# Altium schematic sheet Power.SchDoc
size A; SheetNumber: 1; SheetTotal: 3
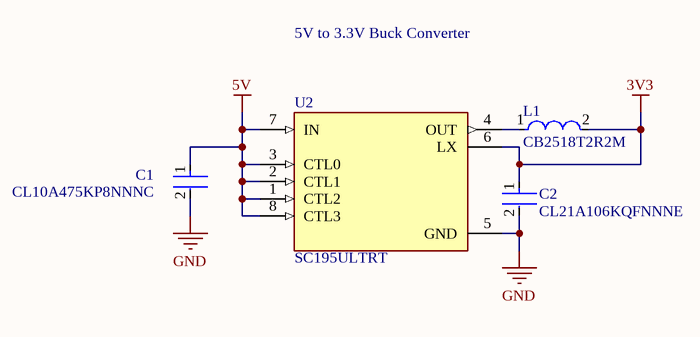
[diagram p0: Power.SchDoc]

## Parts
C1  CL10A475KP8NNNC  [FP-CL10-IPC_C]
C2  CL21A106KQFNNNE  [FP-CL21-IPC_A]
L1  CB2518T2R2M  [FP-CB2518-IPC_C]
U2  SC195ULTRT  [QFN40P150X150X60-8N]

## Nets
3V3: C2.1 L1.2 U2.6(LX)
5V: C1.1 U2.1(CTL2) U2.2(CTL1) U2.3(CTL0) U2.7(IN) U2.8(CTL3)
GND: C1.2 C2.2 U2.5(GND)
NetL1_1: L1.1 U2.4(OUT)

## Notes on the sheet
- 5V to 3.3V Buck Converter

## Library data of the parts
C1 = CMP-13271-003017-1: Cap Ceramic 4.7uF 10V X5R ±10% Pad SMD 0603 +85°C T/R; Capacitance: 4.7uF; Case/Package: 0603; Packaging: Tape and Reel; Width: 0.031inch; Contact Plating: Tin; Thickness: 0.035inch; Package Quantity: 1; Voltage Rating: 10V; Case Code (Metric): 1608; Case Code (Imperial): 0603; Depth: 0.8mm; Height: 0.8mm; Tolerance: 10%; Max Operating Temperature: 85°C; Length: 1.6mm; Dielectric: X5R; Mount: Surface Mount; Radiation Hardening: No; Min Operating Temperature: -55°C
C2 = CMP-13271-001826-1: CL21 Series 0805 10uF 6.3V ±10% Tolerance X5R Multilayer Ceramic Chip Capacitor; Voltage Rating (DC): 6.3V; Thickness: 0.053inch; Min Operating Temperature: -55°C; Mount: Surface Mount; Max Operating Temperature: 85°C; Case Code (Metric): 2012; Dielectric: X5R; Length: 2mm; Case Code (Imperial): 0805; Radiation Hardening: No; Height: 1.25mm; Depth: 1.25mm; Contact Plating: Tin; Voltage Rating: 6.3V; Width: 0.049inch; Package Quantity: 1; Capacitance: 10uF; Packaging: Tape and Reel; Tolerance: 10%; Lead Free: Lead Free; Case/Package: 0805
L1 = CMP-14484-000089-1: SMD Inductors 2.2uH ±20% 1.3A 0.117Ω 1007; Self Resonant Frequency: 68MHz; DC Resistance (DCR): 117mR; Core Material: Ferrite; Saturation Current: 510mA; Test Frequency: 7.96MHz; Shielding: Unshielded; Width: 0.071inch; Max Operating Temperature: 105°C; Tolerance: 20%; Halogen Free: Halogen Free; Length: 0.098inch; Height: 1.8mm; Case Code (Imperial): 1007; Package Quantity: 2000; Inductance: 2.2uH; Case/Package: 1007; Case Code (Metric): 2518; Current Rating: 1.3A; Packaging: Tape and Reel; Depth: 2mm; Mount: Surface Mount; Number of Pins: 2; Series: CB; Radiation Hardening: No; Height - Seated (Max): 0.079inch; Lead Free: Lead Free; Min Operating Temperature: -40°C; Termination: SMD/SMT; Resistor Type: Wirewound; Max DC Current: 510mA
U2 = SC195ULTRT: Buck Switching Regulator IC Positive Programmable 0.8V 1 Output 500mA 8-UFQFN; MF: {'manufacturer': u'Semtech Corporation'}; Value: *; Package: None; MP: SC195ULTRT; Price: None; Availability: Unavailable